# EAGLE schematic Enclosure 100x68 PBCU (EAGLE 9.6.2)
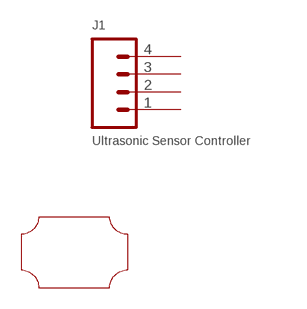
[diagram p0: schematic, sheet 1]

## Parts
J1  Ultrasonic Sensor Controller  HEADER-1X4-GENERIC  [CONN_04-GENERIC]
U$1  PROTO-34X22-CU  [PROTO-34X22-CU]
Unconnected: J1.1 J1.2 J1.3 J1.4

## Library data of the parts
J1 = digitalconcepts:HEADER-1X4-GENERIC: Single Row 4-Pin Header
U$1 = digitalconcepts:PROTO-34X22-CU: 34 x 22 Prototyping board to fit an 100 x 68 enclosure, with cut-out for Ultrasonic Sensor Board